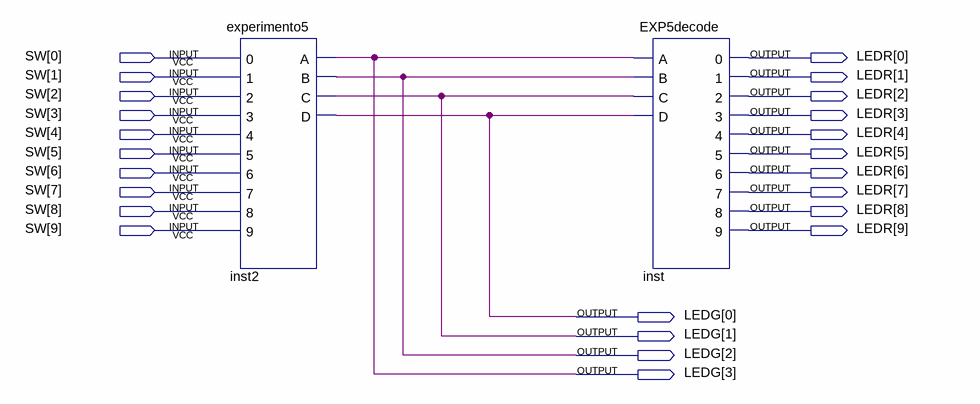
[diagram p0: schematic sheet]
// Quartus schematic Blocoplaca.bdf as structural Verilog: 2 symbols, 24 pins
module Blocoplaca (
  input  [9:0] SW,
  output [9:0] LEDR,
  output [3:0] LEDG
);

  experimento5 inst2 (
    .\0 (SW[0]), .\1 (SW[1]), .\2 (SW[2]), .\3 (SW[3]), .\4 (SW[4]), .\5 (SW[5]), .\6 (SW[6]), .\7 (SW[7]),
    .\8 (SW[8]), .\9 (SW[9]), .A(LEDG[3]), .B(LEDG[2]), .C(LEDG[1]), .D(LEDG[0]));
  EXP5decode inst (
    .A(LEDG[3]), .B(LEDG[2]), .C(LEDG[1]), .D(LEDG[0]), .\0 (LEDR[0]), .\1 (LEDR[1]), .\2 (LEDR[2]),
    .\3 (LEDR[3]), .\4 (LEDR[4]), .\5 (LEDR[5]), .\6 (LEDR[6]), .\7 (LEDR[7]), .\8 (LEDR[8]), .\9 (LEDR[9]));
endmodule
